# Altium project Prj_STM32F103C8T6.PrjPcb
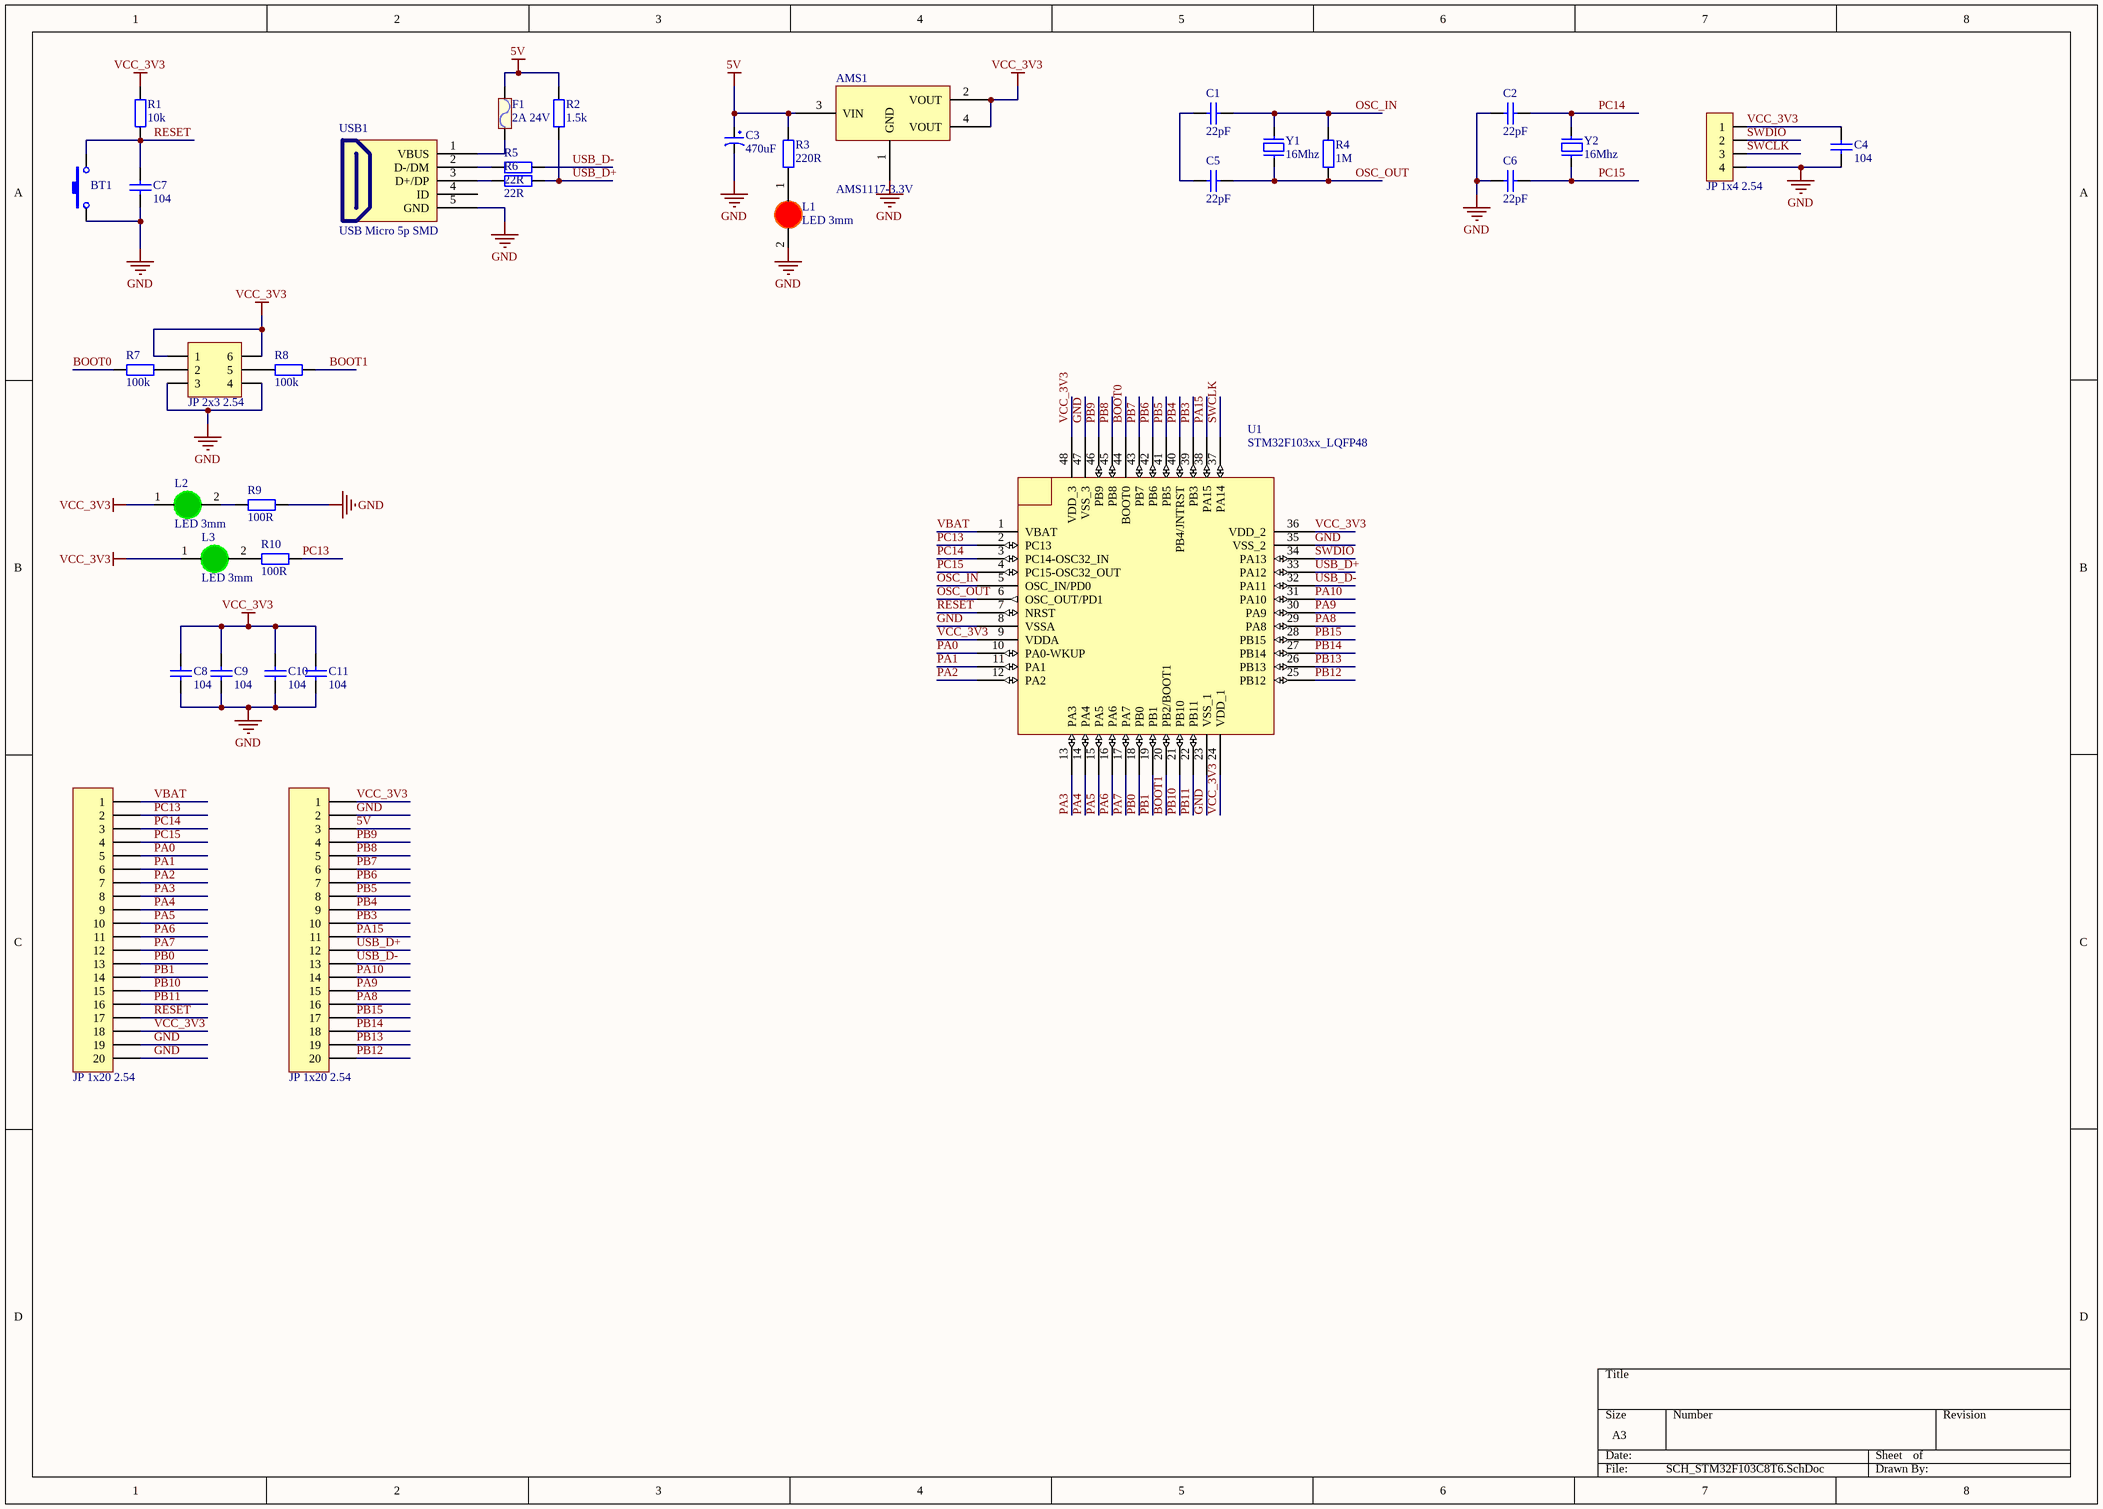
[diagram p0: SCH_STM32F103C8T6.SchDoc]
1 sheet, 35 parts. Net scope: global (net labels, ports and power ports of the same name join across sheets).
Board file: PCB_STM32F103C8T6.PcbDoc

## Sheet SCH_STM32F103C8T6.SchDoc
size A3

### Parts
AMS1  AMS1117-3.3V  [SOT223]
BT1  Nut Nhan 2 Chan SMD 3x6x2.5  [Nut Nhan 2 Chan SMD 3x6x2.5]  (value not drawn)
C1  22pF  [tu 0805]
C2  22pF  [tu 0805]
C3  470uF  [tu hoa 8mm]
C4  104  [tu gom]
C5  22pF  [tu 0805]
C6  22pF  [tu 0805]
C7  104  [tu 0805]
C8  104  [tu 0805]
C9  104  [tu 0805]
C10  104  [tu 0805]
C11  104  [tu 0805]
F1  2A 24V  [Cau chi tu phuc hoi 2A 24V SMD1812]
JP1  JP 1x4 2.54  [JP 1x4 DC]
JP2  JP 2x3 2.54  [JP 2x3 DT]
JP3  JP 1x20 2.54  [JP 1x20 DT]
JP4  JP 1x20 2.54  [JP 1x20 DT]
L1  LED 3mm  [LED-3MM-RED]
L2  LED 3mm  [LED-3MM-GREEN]
L3  LED 3mm  [LED-3MM-GREEN]
R1  10k  [tro smd 0805]
R2  1.5k  [tro smd 0805]
R3  220R  [tro smd 0805]
R4  1M  [tro smd 0805]
R5  22R  [tro smd 0805]
R6  22R  [tro smd 0805]
R7  100k  [tro smd 0603]
R8  100k  [tro smd 0603]
R9  100R  [tro smd 0805]
R10  100R  [tro smd 0805]
U1  STM32F103xx_LQFP48  [STM32_LQPF48]
USB1  USB Micro 5p SMD  [USB Micro 5p SMD]
Y1  16Mhz  [Thach Anh 2 chan cam]
Y2  16Mhz  [Thach Anh 2 Chan 32,768 KHz]

### Nets
5V: AMS1.3(VIN) C3.1 F1.2 JP4.3 R2.2 R3.2
GND: AMS1.1(GND) BT1.1 C2.2 C3.2 C4.2 C6.2 C7.2 C8.2 C9.2 C10.2 C11.2 JP1.4 JP2.3 JP2.4 JP3.19 JP3.20 JP4.2 L1.2(K) R9.2 U1.8(VSSA) U1.23(VSS_1) U1.35(VSS_2) U1.47(VSS_3) USB1.5(GND)
VCC_3V3: AMS1.2(VOUT) AMS1.4(VOUT) C4.1 C8.1 C9.1 C10.1 C11.1 JP1.1 JP2.1 JP2.6 JP3.18 JP4.1 L2.1(A) L3.1(A) R1.2 U1.9(VDDA) U1.24(VDD_1) U1.36(VDD_2) U1.48(VDD_3)
BOOT0: R7.1 U1.44(BOOT0)
BOOT1: R8.2 U1.20(PB2/BOOT1)
OSC_IN: C1.1 R4.2 U1.5(OSC_IN/PD0) Y1.1
OSC_OUT: C5.1 R4.1 U1.6(OSC_OUT/PD1) Y1.2
PA0: JP3.5 U1.10(PA0-WKUP)
PA1: JP3.6 U1.11(PA1)
PA2: JP3.7 U1.12(PA2)
PA3: JP3.8 U1.13(PA3)
PA4: JP3.9 U1.14(PA4)
PA5: JP3.10 U1.15(PA5)
PA6: JP3.11 U1.16(PA6)
PA7: JP3.12 U1.17(PA7)
PA8: JP4.16 U1.29(PA8)
PA9: JP4.15 U1.30(PA9)
PA10: JP4.14 U1.31(PA10)
PA15: JP4.11 U1.38(PA15)
PB0: JP3.13 U1.18(PB0)
PB1: JP3.14 U1.19(PB1)
PB3: JP4.10 U1.39(PB3)
PB4: JP4.9 U1.40(PB4/JNTRST)
PB5: JP4.8 U1.41(PB5)
PB6: JP4.7 U1.42(PB6)
PB7: JP4.6 U1.43(PB7)
PB8: JP4.5 U1.45(PB8)
PB9: JP4.4 U1.46(PB9)
PB10: JP3.15 U1.21(PB10)
PB11: JP3.16 U1.22(PB11)
PB12: JP4.20 U1.25(PB12)
PB13: JP4.19 U1.26(PB13)
PB14: JP4.18 U1.27(PB14)
PB15: JP4.17 U1.28(PB15)
PC13: JP3.2 R10.2 U1.2(PC13)
PC14: C2.1 JP3.3 U1.3(PC14-OSC32_IN) Y2.2
PC15: C6.1 JP3.4 U1.4(PC15-OSC32_OUT) Y2.1
RESET: BT1.2 C7.1 JP3.17 R1.1 U1.7(NRST)
SWCLK: JP1.3 U1.37(PA14)
SWDIO: JP1.2 U1.34(PA13)
USB_D+: JP4.12 R2.1 R6.2 U1.33(PA12)
USB_D-: JP4.13 R5.2 U1.32(PA11)
VBAT: JP3.1 U1.1(VBAT)
NetC1_2: C1.2 C5.2
NetF1_1: F1.1 USB1.1(VBUS)
NetJP2_2: JP2.2 R7.2
NetJP2_5: JP2.5 R8.1
NetL1_1: L1.1(A) R3.1
NetL2_2: L2.2(K) R9.1
NetL3_2: L3.2(K) R10.1
NetR5_1: R5.1 USB1.2(D-/DM)
NetR6_1: R6.1 USB1.3(D+/DP)

Not connected (* = marked no-connect by the designer): USB1 4(ID)

### Library data of the parts
AMS1 = AMS1117 SMD: Dán; Value: AMS1117-3.3V SOT223; Don_Vi: Con; Ma_Hang: MH000596; Ghi_Chu: *; Kieu_Chan: *; Chung_Loai: Dán
BT1 = Nut Nhan 2 Chan SMD 3x6x2.5: Ma_Hang: MH001036; Ten: Nút Nhấn 2 Chân 3x6x2.5MM SMD
C1 C2 C5 C6 = Tu 0805 22pF 50V 10%: Dán; Don_Vi: Con; So_Chan: 2; Ten_Linh_Kien: Tụ 0805 22P 10% 50V; Ma_Hang: MH004560; Chung_Loai: Dán; Kieu_Chan: *
C3 = Tu Hoa 470uF 16V 8x11: Cắm; Don_Vi: Con; So_Chan: 2; Ten_Linh_Kien: Tụ Hóa 470uF 16V 8x11MM; Ma_Hang: MH006550; Chung_Loai: Cắm; Kieu_Chan: *
C4 = Tu gom 104 50V: Cắm; So_Chan: 2; Ten_Linh_Kien: Tụ gốm 104 100nF 50V; Don_Vi: Con; Ma_Hang: MH004761; Chung_Loai: Cắm; Kieu_Chan: *
C7-C11 = Tu 0805 104 50V 10%: Dán; Don_Vi: Con; So_Chan: 2; Ten_Linh_Kien: Tụ 0805 104-100nF 10% 50V; Ma_Hang: MH004551; Chung_Loai: Dán; Kieu_Chan: *
F1 = Cau chi tu phuc hoi 2A 24V SMD1812: 2A 24V SMD1812; Ma_Hang: MH010033; Ten: Cầu Chì Tự Phục Hồi 2A 24V SMD1812
JP1 = JP 1x4 2.54 Duc Cong: Cắm; Ten_Linh_Kien: Jump Đơn Đực 2.54MM 1x40P Cong Đứng; Don_Vi: Con; Ma_Hang: MH000904; Ghi_Chu: *; Kieu_Chan: *; Chung_Loai: Cắm
JP2 = JP 2x3 2.54 Duc Thang: Cắm; Ten_Linh_Kien: Jump Đôi Đực 2.54MM 2x40P Thẳng 11MM; Don_Vi: Con; Ma_Hang: MH002686; Ghi_Chu: *; Kieu_Chan: *; Chung_Loai: Cắm
JP3 JP4 = JP 1x20 2.54 Duc Thang: Cắm; Ten_Linh_Kien: Jump Đơn Đực 2.54MM 1x40P Thẳng 11MM; Don_Vi: Con; Ma_Hang: MH000903; Ghi_Chu: *; Kieu_Chan: *; Chung_Loai: Cắm
L1 = LED 3mm Do: Cắm; Don_Vi: Con; Ma_Hang: MH003892; Ten_Linh_Kien: Led 3MM Phủ Đỏ (10c); Ghi_Chu: *; Kieu_Chan: *; Chung_Loai: Cắm
L2 L3 = LED 3mm Xanh La: Cắm; Don_Vi: Con; Ma_Hang: MH001054; Ten_Linh_Kien: Led 3MM Phủ Xanh (10c); Ghi_Chu: *; Kieu_Chan: *; Chung_Loai: Cắm
R1 = Tro 0805 1% 10k: Dán; Don_Vi: Con; So_Chan: 2; Ten_Linh_Kien: Trở 0805 1% 10k; Ma_Hang: MH005473; Chung_Loai: Dán; Kieu_Chan: *
R2 = Tro 0805 5% 1.5k: Dán; Don_Vi: Con; So_Chan: 2; Ten_Linh_Kien: Trở 0805 5% 1.5k; Ma_Hang: MH005232; Chung_Loai: Dán; Kieu_Chan: *
R3 = Tro 0805 5% 220R: Dán; Don_Vi: Con; So_Chan: 2; Ten_Linh_Kien: Trở 0805 5% 220R; Ma_Hang: MH005259; Chung_Loai: Dán; Kieu_Chan: *
R4 = Tro 0805 5% 1M: Dán; Don_Vi: Con; So_Chan: 2; Ten_Linh_Kien: Trở 0805 5% 1M; Ma_Hang: MH005235; Chung_Loai: Dán; Kieu_Chan: *
R5 R6 = Tro 0805 5% 22R: Dán; Don_Vi: Con; So_Chan: 2; Ten_Linh_Kien: Trở 0805 5% 22R; Ma_Hang: MH005249; Chung_Loai: Dán; Kieu_Chan: *
R7 R8 = Tro 0603 5% 100k: Dán; So_Chan: 2; Ten_Linh_Kien: Trở 0603 5% 100k; Ma_Hang: MH006314; Don_Vi: Con; Chung_Loai: Dán; Kieu_Chan: *
R9 R10 = Tro 0805 5% 100R: Dán; Don_Vi: Con; So_Chan: 2; Ten_Linh_Kien: Trở 0805 5% 100R; Ma_Hang: MH005251; Chung_Loai: Dán; Kieu_Chan: *
USB1 = USB Micro 5p SMD: USB Type B; Ten: MicroUSB MK5P SMD; Ma_Hang: MH001020
Y1 = Thach Anh 2 chan Cam: Crystal For all Crystal 2pin.; Value: 4Mhz
Y2 = Thach Anh 2 chan 32,768 Khz: Crystal For all Crystal 2pin.; Value: 4Mhz
U1 = STM32F103xx_LQFP48: Published: 30-May-2008; DatasheetVersion: rev6, Mar-2008; PackageVersion: Mar-2008; PackageReference: LQFP48; Publisher: Altium Limited; PackageDescription: 48-Pin Low-Profile Quad Flat Pack, 7 x 7 mm Body, 0.5 mm Pitch (LQFP48); ComponentLink1Description: Manufacturer Link; ComponentLink1URL: www.st.com/stm32; ComponentLink2Description: Datasheet; ComponentLink2URL: http://www.st.com/stonline/products/literature/ds/13587.pdf